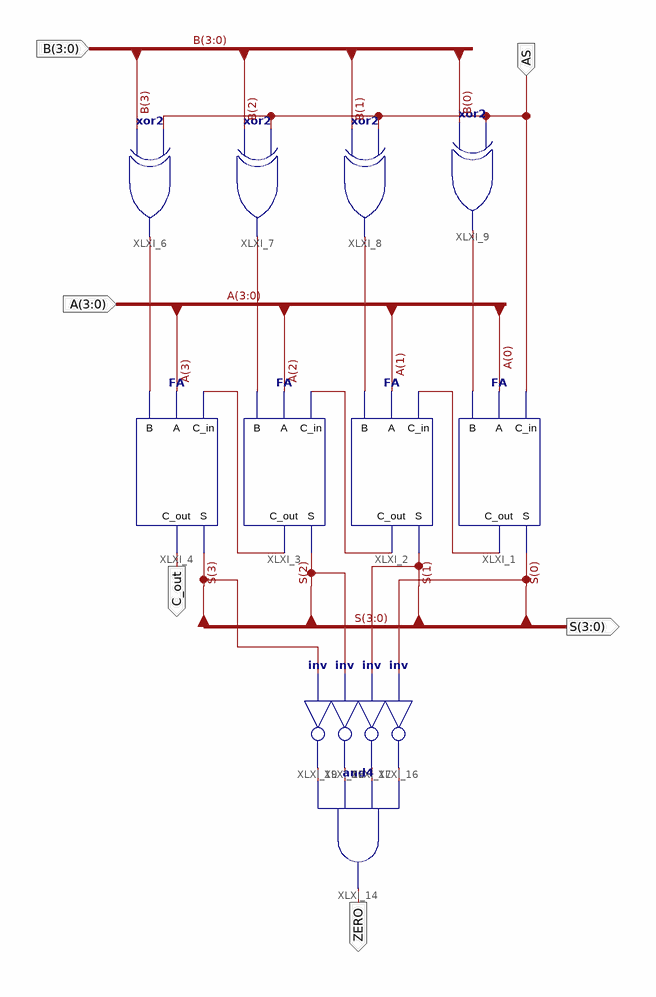
[diagram p0: schematic sheet 1]
// Xilinx ISE schematic RCA_4.sch (spartan3e) as structural Verilog: 13 symbols, 6 ports
module RCA_4 (
  input  AS,
  input  [3:0] B,
  input  [3:0] A,
  output C_out,
  output [3:0] S,
  output ZERO
);

  wire XLXN_1, XLXN_2, XLXN_3, XLXN_18, XLXN_19, XLXN_20, XLXN_21, XLXN_65, XLXN_66, XLXN_67, XLXN_68;

  xor XLXI_6 (XLXN_18, B[3], AS);
  xor XLXI_7 (XLXN_19, B[2], AS);
  xor XLXI_8 (XLXN_20, B[1], AS);
  xor XLXI_9 (XLXN_21, B[0], AS);
  FA XLXI_1 (.A(A[0]), .B(XLXN_21), .C_in(AS), .C_out(XLXN_1), .S(S[0]));
  FA XLXI_2 (.A(A[1]), .B(XLXN_20), .C_in(XLXN_1), .C_out(XLXN_2), .S(S[1]));
  FA XLXI_3 (.A(A[2]), .B(XLXN_19), .C_in(XLXN_2), .C_out(XLXN_3), .S(S[2]));
  FA XLXI_4 (.A(A[3]), .B(XLXN_18), .C_in(XLXN_3), .C_out(C_out), .S(S[3]));
  and XLXI_14 (ZERO, XLXN_68, XLXN_67, XLXN_66, XLXN_65);
  not XLXI_16 (XLXN_65, S[0]);
  not XLXI_17 (XLXN_66, S[1]);
  not XLXI_18 (XLXN_67, S[2]);
  not XLXI_19 (XLXN_68, S[3]);
endmodule
